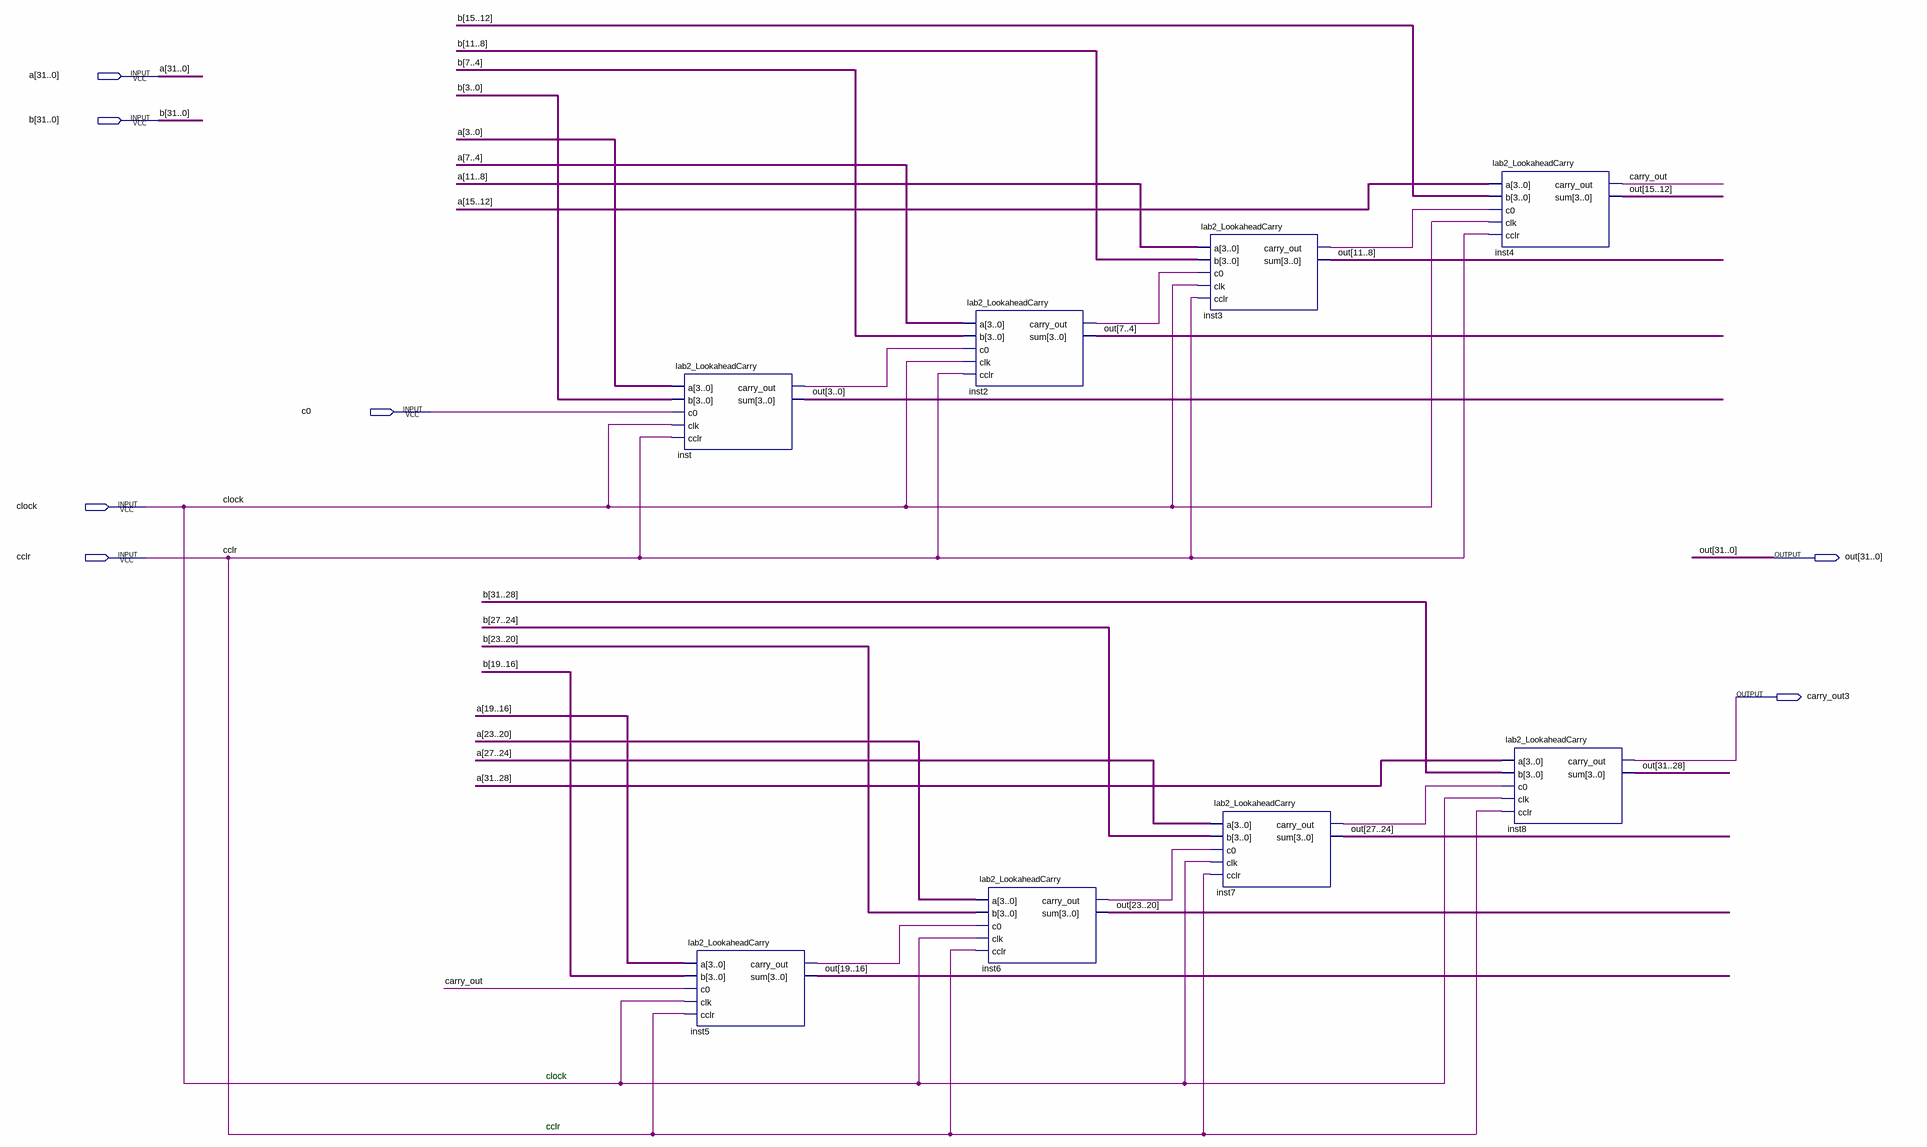
[diagram p0: schematic sheet]
// Quartus schematic lab2_3.bdf as structural Verilog: 8 symbols, 7 pins
module lab2_3 (
  input  [31:0] a,
  input  [31:0] b,
  input  c0,
  input  clock,
  input  cclr,
  output [31:0] out,
  output carry_out3
);

  wire carry_out, inst2_carry_out, inst3_carry_out, inst5_carry_out, inst6_carry_out, inst7_carry_out,
       inst_carry_out;

  lab2_LookaheadCarry inst (
    .a(a[3:0]), .b(b[3:0]), .c0(c0), .clk(clock), .cclr(cclr), .carry_out(inst_carry_out), .sum(out[3:0]));
  lab2_LookaheadCarry inst5 (
    .a(a[19:16]), .b(b[19:16]), .c0(carry_out), .clk(clock), .cclr(cclr), .carry_out(inst5_carry_out),
    .sum(out[19:16]));
  lab2_LookaheadCarry inst2 (
    .a(a[7:4]), .b(b[7:4]), .c0(inst_carry_out), .clk(clock), .cclr(cclr), .carry_out(inst2_carry_out),
    .sum(out[7:4]));
  lab2_LookaheadCarry inst6 (
    .a(a[23:20]), .b(b[23:20]), .c0(inst5_carry_out), .clk(clock), .cclr(cclr), .carry_out(inst6_carry_out),
    .sum(out[23:20]));
  lab2_LookaheadCarry inst3 (
    .a(a[11:8]), .b(b[11:8]), .c0(inst2_carry_out), .clk(clock), .cclr(cclr), .carry_out(inst3_carry_out),
    .sum(out[11:8]));
  lab2_LookaheadCarry inst7 (
    .a(a[27:24]), .b(b[27:24]), .c0(inst6_carry_out), .clk(clock), .cclr(cclr), .carry_out(inst7_carry_out),
    .sum(out[27:24]));
  lab2_LookaheadCarry inst4 (
    .a(a[15:12]), .b(b[15:12]), .c0(inst3_carry_out), .clk(clock), .cclr(cclr), .carry_out(carry_out),
    .sum(out[15:12]));
  lab2_LookaheadCarry inst8 (
    .a(a[31:28]), .b(b[31:28]), .c0(inst7_carry_out), .clk(clock), .cclr(cclr), .carry_out(carry_out3),
    .sum(out[31:28]));

  // Notes on the sheet:
  //   clock
  //   cclr
endmodule
